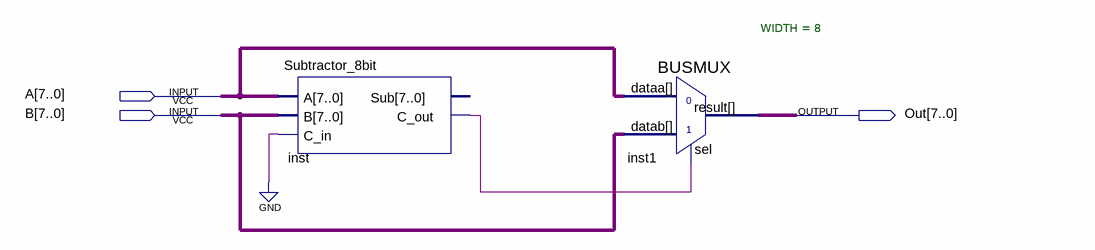
[diagram p0: schematic sheet]
// Quartus schematic Max_8bit.bdf as structural Verilog: 2 symbols, 3 pins
module Max_8bit (
  input  [7:0] A,
  input  [7:0] B,
  output [7:0] Out
);

  wire inst_c_out;

  Subtractor_8bit inst (.A(A), .B(B), .C_in(1'b0), .C_out(inst_c_out));  // open: Sub
  BUSMUX #(.WIDTH(8)) inst1 (.datab(B), .sel(inst_c_out), .dataa(A), .result(Out));
endmodule
